# EAGLE design FabTouche (EAGLE 6.5.0)
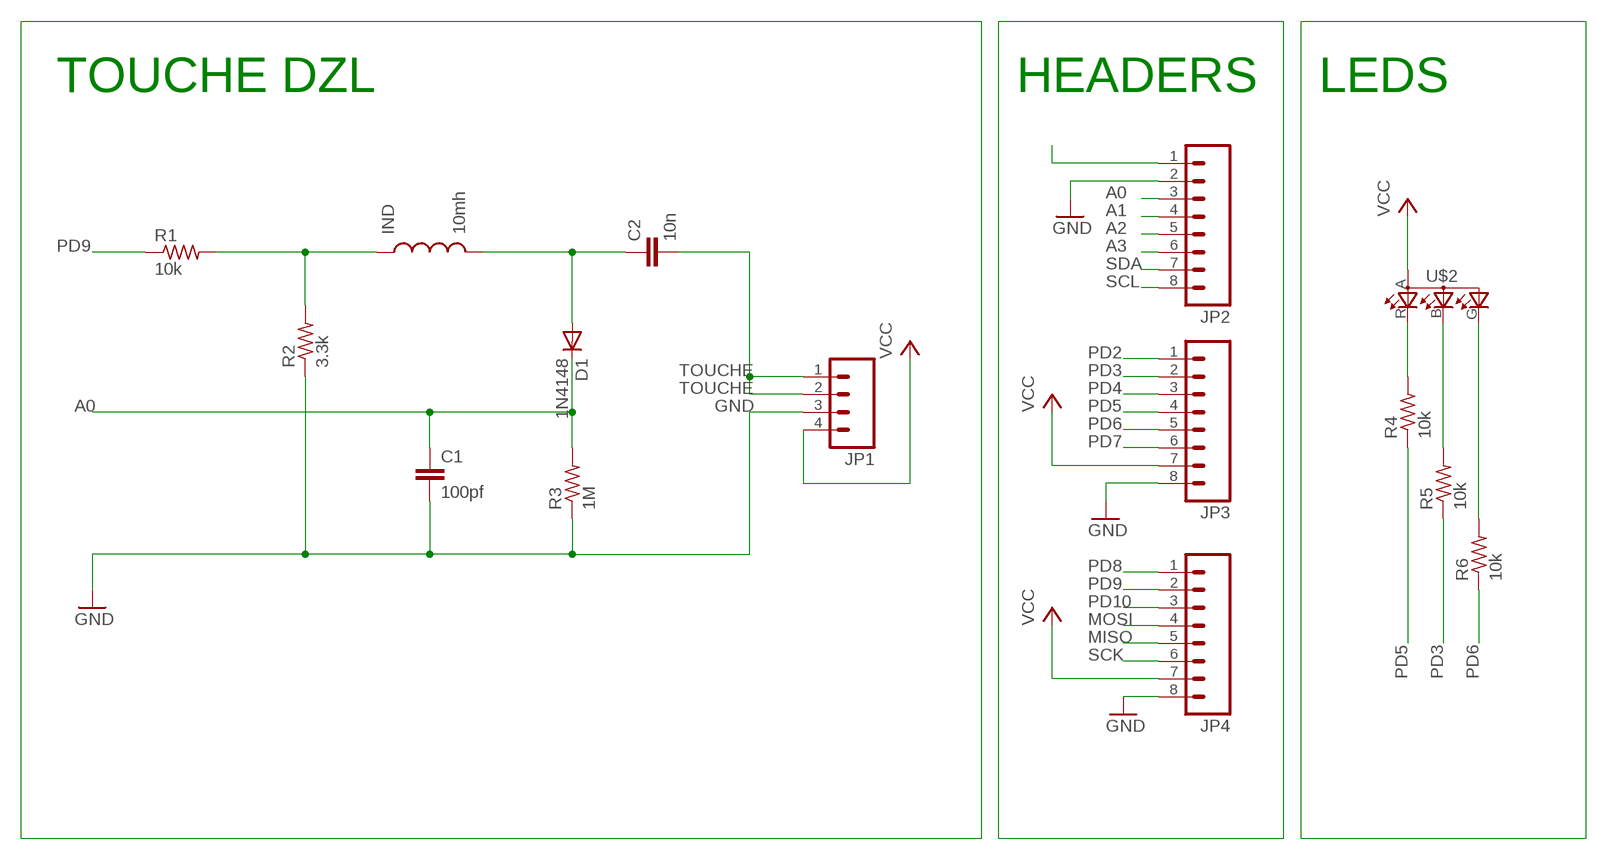
[diagram p0: schematic, sheet 1]

## Parts
C1  100pf  CAP1206  [1206]
C2  10n  CAP1206  [1206]
D1  1N4148  DIODESOD123  [SOD123]
IND  10mh  INDUCTOR  [CDRH3D28]
JP1  M04PTH  [1X04]
JP2  M08  [1X08]
JP3  M08  [1X08]
JP4  M08  [1X08]
R1  10k  RESISTOR1206  [1206]
R2  3.3k  RESISTOR1206  [1206]
R3  1M  RESISTOR1206  [1206]
R4  10k  RESISTOR1206  [1206]
R5  10k  RESISTOR1206  [1206]
R6  10k  RESISTOR1206  [1206]
U$2  LEDRGBOLD  [P-LCC-4-3]

## Nets
A0: C1.1 D1.CATHODE(C) JP2.3 R3.2
A1: JP2.4
A2: JP2.5
A3: JP2.6
GND: C1.2 JP1.3 JP2.2 JP3.8 JP4.8 R2.1 R3.1
MISO: JP4.5
MOSI: JP4.4
N$1: C2.1 D1.ANODE(A) IND.2
N$2: IND.1 R1.2 R2.2
N$3: JP2.1
N$12: R4.2 U$2.R(CRED)
N$15: R5.2 U$2.B(CBLUE)
N$20: R6.2 U$2.G(CGREEN)
PD2: JP3.1
PD3: JP3.2 R5.1
PD4: JP3.3
PD5: JP3.4 R4.1
PD6: JP3.5 R6.1
PD7: JP3.6
PD8: JP4.1
PD9: JP4.2 R1.1
PD10: JP4.3
SCK: JP4.6
SCL: JP2.8
SDA: JP2.7
TOUCHE: C2.2 JP1.1 JP1.2
VCC: JP1.4 JP3.7 JP4.7 U$2.A(A2)

## Notes on the sheet
- TOUCHE DZL | HEADERS | LEDS

## Library data of the parts
C1 C2 = 01_SparkFun:CAP: Capacitor Standard 0603 ceramic capacitor, and 0.1" leaded capacitor.
D1 = 01_fab:DIODE: DIODE high speed (Philips)
IND = 01_SparkFun:INDUCTOR: Inductors Basic Inductor/Choke - 0603 and 1206. Footprints are not proven and vary greatly between part numbers.
JP1 = 01_SparkFun:M04: Header 4 Standard 4-pin 0.1" header. Use with straight break away headers (SKU : PRT-00116), right angle break away headers (PRT-00553), swiss pins (PRT-00743), machine pins (PRT-00117), and female headers (PRT-00115). Molex polarized connector foot print use with SKU : PRT-08231 with associated crimp pins and housings.
JP2-JP4 = 01_SparkFun:M08: Header 8 Standard 8-pin 0.1" header. Use with straight break away headers (SKU : PRT-00116), right angle break away headers (PRT-00553), swiss pins (PRT-00743), machine pins (PRT-00117), and female headers (PRT-00115).
R1-R6 = 01_FAB_Hello:RESISTOR
U$2 = 01_fab:LEDRGBOLD: OSRAM Hyper Multi TOPLED® Hyper-Bright LED LATB T686 Source: http://www.osram.convergy.de/

## Board
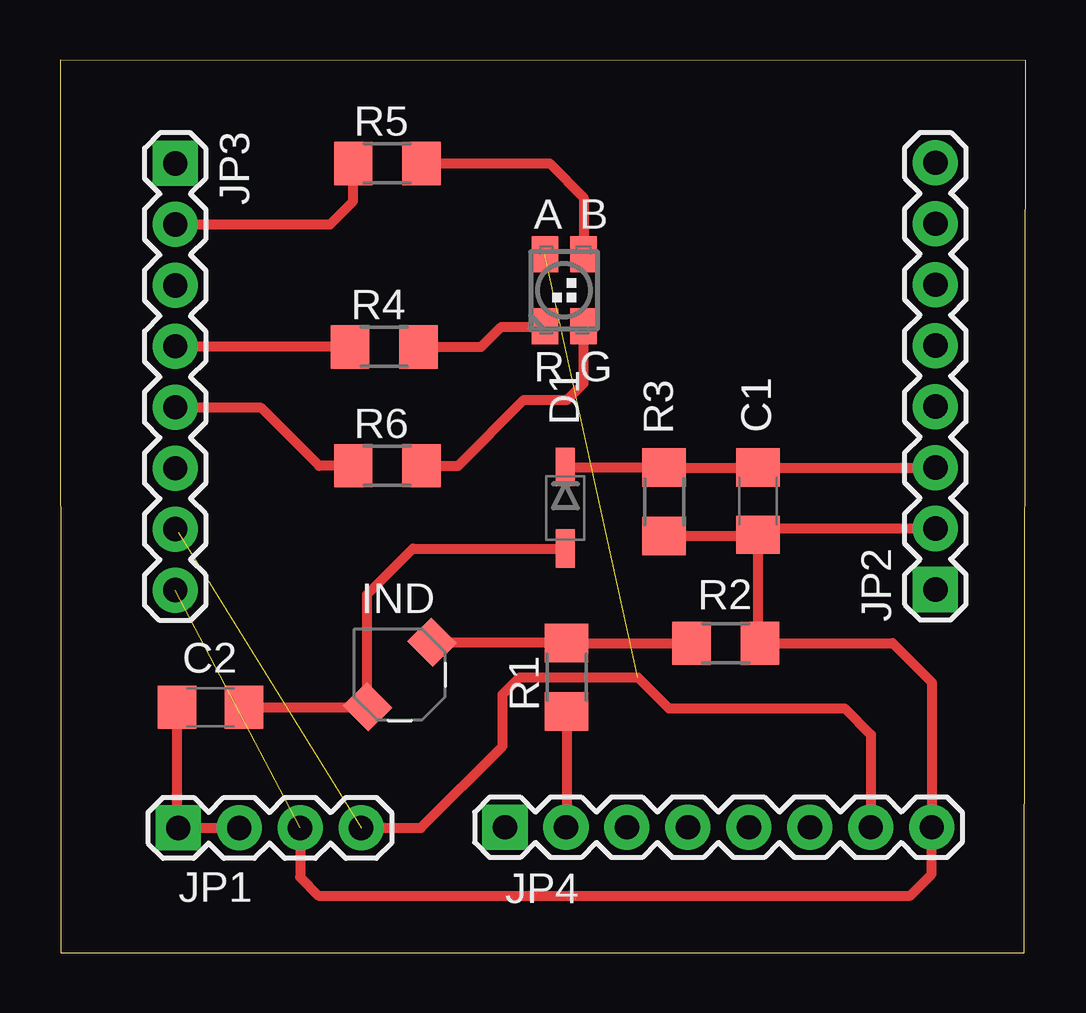
[diagram p1: board, top side]

Size 40.23 x 37.2 mm. Coordinates in mm from the lower left corner, seen from the top.
Outline: 0.03,0 40.18,0 40.23,37.18 0,37.2 0.03,0
Copper layers (1*16): Top 0.035mm / dielectric 1.5mm / Bottom 0.035mm
Design rules "default": minimum track width 10mil, minimum drill 24mil, track to track 8mil, track to pad 8mil, pad to pad 8mil, via to via 8mil, smd to smd 8mil, copper to edge 40mil, drill to drill 8mil, minimum pad ring 10mil, minimum via ring 8mil, stop-mask expansion 4mil, vias tented up to drill 0mil, thermal gap 10mil

### Footprints (pad centres in the part's own frame; a part is rotated, then mirrored left to right if it is on the bottom)
1206 = smd 1.6 x 1.8: 1 -1.4,0; 2 1.4,0
SOD123 = smd 1.6 x 0.8: ANODE 1.7,0; CATHODE -1.7,0
CDRH3D28 = smd 1.5 x 1.4 rotated 315: 1 -1.374,-1.384; 2 1.312,1.302
1X04 = drill 1.016 pad 1.88 square: 1 0,0 | drill 1.016 pad 1.88: 2 2.54,0; 3 5.08,0; 4 7.62,0
1X08 = drill 1.016 pad 1.88 square: 1 0,0 | drill 1.016 pad 1.88: 2 2.54,0; 3 5.08,0; 4 7.62,0; 5 10.16,0; 6 12.7,0; 7 15.24,0; 8 17.78,0
1206' = smd 1.6 x 1.803: 1 -1.422,0; 2 1.422,0
P-LCC-4-3 = smd 1.1 x 1.5: A -0.8,1.5; B 0.8,1.5; G 0.8,-1.5; R -0.8,-1.5

### Placement (x,y rotation side)
C1  29.08,18.82 270 top
C2  6.27,10.24 180 top
D1  21.06,18.54 270 top
IND  14.12,11.56 180 top
JP1  4.93,5.21 0 top
JP2  36.47,15.14 90 top
JP3  4.8,32.89 270 top
JP4  18.54,5.23 0 top
R1  10k  [1206']  21.11,11.48 90 top
R2  3.3k  [1206']  27.74,12.9 180 top
R3  1M  [1206']  25.17,18.8 90 top
R4  10k  [1206']  13.51,25.25 0 top
R5  10k  [1206']  13.64,32.89 0 top
R6  10k  [1206']  13.64,20.29 0 top
U$2  21.01,27.61 0 top

### Tracks (layer width: path | path; a pad name or v marks a point on that pad's centre or on a via)
A0
  Top 0.406: D1.CATHODE 25.15,20.24 R3.2 C1.1 JP2.3
GND  (1 unrouted)
  Top 0.406: R2.1 34.7,12.9 36.32,11.28 JP4.8 36.32,3.28 35.43,2.39 10.77,2.39 10.01,3.15 JP1.3 | 29.14,12.93 R2.1 | R3.1 29.04,17.37 C1.2 | C1.2 29.08,12.98 R2.1 | JP2.2 29.34,17.68 C1.2
N$1
  Top 0.406: C2.1 12.79,10.24 IND.2 12.81,10.17 12.8,10.16 12.8,14.94 14.71,16.84 D1.ANODE
N$2
  Top 0.406: IND.1 21.07,12.94 R1.2 R2.2
N$12
  Top 0.406: R4.2 17.55,25.25 18.39,26.09 20.18,26.09 U$2.R
N$15
  Top 0.406: R5.2 20.4,32.89 21.82,31.47 21.82,29.12 U$2.B
N$20
  Top 0.406: R6.2 16.59,20.29 19.33,23.04 21.13,23.04 21.82,23.72 21.82,26.1 U$2.G
PD3
  Top 0.406: JP3.2 11.25,30.35 12.22,31.32 R5.1 | R5.1
PD5
  Top 0.406: R4.1 4.83,25.25 JP3.4
PD6
  Top 0.406: R6.1 10.79,20.29 8.38,22.71 4.83,22.71 JP3.5
PD9
  Top 0.406: R1.1 21.11,5.26 JP4.2
TOUCHE
  Top 0.406: C2.2 4.87,5.26 JP1.1 JP1.2
VCC  (2 unrouted)
  Top 0.406: JP1.4 15.04,5.21 18.44,8.61 18.44,10.77 19.15,11.48 24.08,11.48 25.37,10.19 32.69,10.19 33.78,9.09 JP4.7 | JP3.7 4.93,17.53